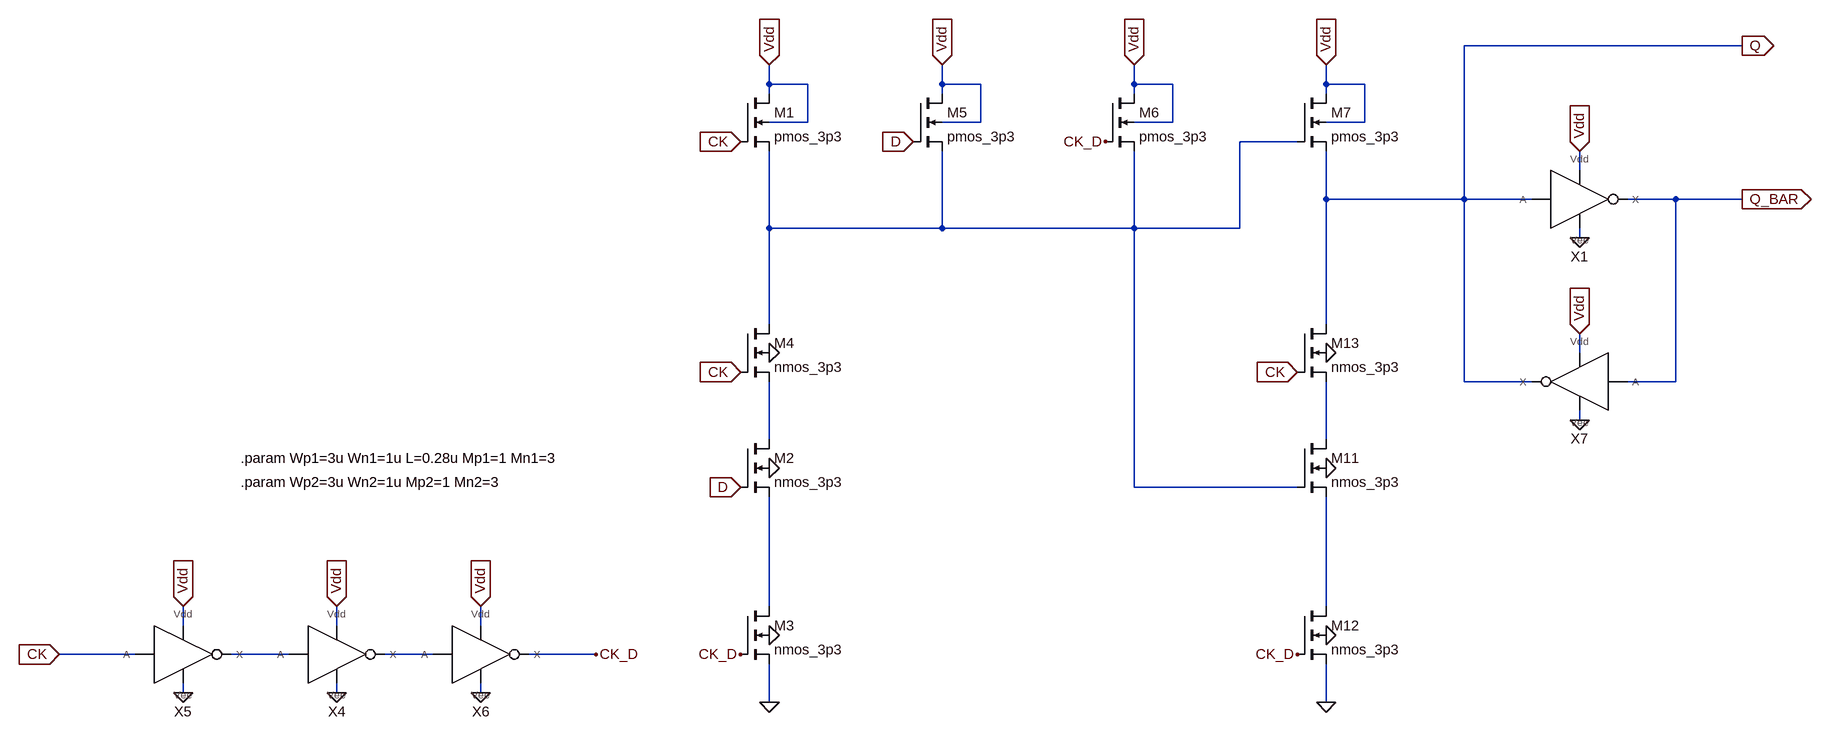
[diagram p0: schematic HLFF.asc]
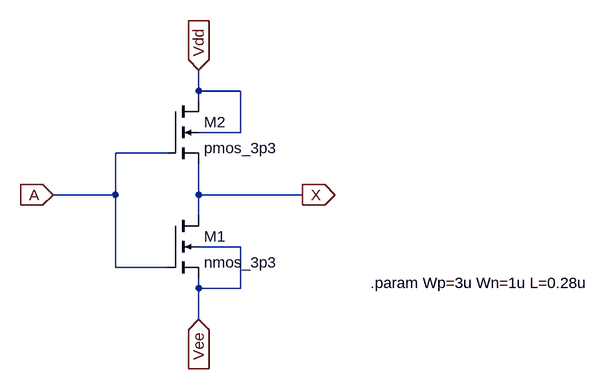
[diagram p1: sub-circuit invx1.asc]
HLFF.asc, the LTspice schematic file:
Version 4
SHEET 1 4028 772
WIRE 560 -608 64 -608
WIRE -1216 -544 -1216 -576
WIRE -1152 -544 -1216 -544
WIRE -928 -544 -928 -576
WIRE -864 -544 -928 -544
WIRE -608 -544 -608 -576
WIRE -544 -544 -608 -544
WIRE -288 -544 -288 -576
WIRE -224 -544 -288 -544
WIRE -1216 -528 -1216 -544
WIRE -928 -528 -928 -544
WIRE -608 -528 -608 -544
WIRE -288 -528 -288 -544
WIRE -1152 -480 -1152 -544
WIRE -1152 -480 -1216 -480
WIRE -864 -480 -864 -544
WIRE -864 -480 -928 -480
WIRE -544 -480 -544 -544
WIRE -544 -480 -608 -480
WIRE -224 -480 -224 -544
WIRE -224 -480 -288 -480
WIRE -336 -448 -432 -448
WIRE 256 -400 256 -432
WIRE -288 -352 -288 -432
WIRE 64 -352 64 -608
WIRE 64 -352 -288 -352
WIRE 176 -352 64 -352
WIRE 416 -352 336 -352
WIRE 560 -352 416 -352
WIRE -1216 -304 -1216 -432
WIRE -928 -304 -928 -432
WIRE -928 -304 -1216 -304
WIRE -608 -304 -608 -432
WIRE -608 -304 -928 -304
WIRE -432 -304 -432 -448
WIRE -432 -304 -608 -304
WIRE 256 -288 256 -304
WIRE -1216 -144 -1216 -304
WIRE -288 -144 -288 -352
WIRE 256 -96 256 -128
WIRE 64 -48 64 -352
WIRE 176 -48 64 -48
WIRE 416 -48 416 -352
WIRE 416 -48 336 -48
WIRE 256 16 256 0
WIRE -1216 48 -1216 -48
WIRE -288 48 -288 -48
WIRE -608 128 -608 -304
WIRE -336 128 -608 128
WIRE -1216 400 -1216 144
WIRE -288 400 -288 144
WIRE -2368 432 -2368 400
WIRE -2112 432 -2112 400
WIRE -1872 432 -1872 400
WIRE -2448 480 -2576 480
WIRE -2192 480 -2288 480
WIRE -1952 480 -2032 480
WIRE -1680 480 -1792 480
WIRE -2368 544 -2368 528
WIRE -2112 544 -2112 528
WIRE -1872 544 -1872 528
WIRE -1216 560 -1216 496
WIRE -288 560 -288 496
FLAG -1216 -576 Vdd
IOPIN -1216 -576 In
FLAG -1264 -448 CK
IOPIN -1264 -448 In
FLAG -1216 560 0
FLAG -1216 448 0
FLAG -1216 96 0
FLAG -1216 -96 0
FLAG -2576 480 CK
IOPIN -2576 480 In
FLAG -928 -576 Vdd
IOPIN -928 -576 In
FLAG -608 -576 Vdd
IOPIN -608 -576 In
FLAG -288 -576 Vdd
IOPIN -288 -576 In
FLAG -288 560 0
FLAG -288 448 0
FLAG -288 96 0
FLAG -288 -96 0
FLAG -2368 544 0
FLAG -2368 400 Vdd
IOPIN -2368 400 In
FLAG -2112 400 Vdd
IOPIN -2112 400 In
FLAG -1872 400 Vdd
IOPIN -1872 400 In
FLAG -2112 544 0
FLAG -1872 544 0
FLAG -1680 480 CK_D
FLAG -1264 -64 CK
IOPIN -1264 -64 In
FLAG -1264 128 D
IOPIN -1264 128 In
FLAG -976 -448 D
IOPIN -976 -448 In
FLAG -656 -448 CK_D
FLAG -336 480 CK_D
FLAG 256 -432 Vdd
IOPIN 256 -432 In
FLAG 256 -288 0
FLAG 256 -128 Vdd
IOPIN 256 -128 In
FLAG 256 16 0
FLAG 560 -608 Q
IOPIN 560 -608 Out
FLAG 560 -352 Q_BAR
IOPIN 560 -352 Out
FLAG -336 -64 CK
IOPIN -336 -64 In
FLAG -1264 480 CK_D
SYMBOL nmos4 -1264 -528 R0
SYMATTR InstName M1
SYMATTR Value pmos_3p3
SYMATTR Value2 l={L} w={Wp1} m={Mp1}
SYMBOL nmos4 -1264 48 R0
SYMATTR InstName M2
SYMATTR Value nmos_3p3
SYMATTR Value2 l={L} w={Wn1} m={Mn1}
SYMBOL nmos4 -1264 400 R0
SYMATTR InstName M3
SYMATTR Value nmos_3p3
SYMATTR Value2 l={L} w={Wn1} m={Mn1}
SYMBOL nmos4 -1264 -144 R0
SYMATTR InstName M4
SYMATTR Value nmos_3p3
SYMATTR Value2 l={L} w={Wn1} m={Mn1}
SYMBOL nmos4 -976 -528 R0
SYMATTR InstName M5
SYMATTR Value pmos_3p3
SYMATTR Value2 l={L} w={Wp1} m={Mp1}
SYMBOL nmos4 -656 -528 R0
SYMATTR InstName M6
SYMATTR Value pmos_3p3
SYMATTR Value2 l={L} w={Wp1} m={Mp1}
SYMBOL nmos4 -336 -528 R0
SYMATTR InstName M7
SYMATTR Value pmos_3p3
SYMATTR Value2 l={L} w={Wp2} m={Mp2}
SYMBOL nmos4 -336 48 R0
SYMATTR InstName M11
SYMATTR Value nmos_3p3
SYMATTR Value2 l={L} w={Wn2} m={Mn2}
SYMBOL nmos4 -336 400 R0
SYMATTR InstName M12
SYMATTR Value nmos_3p3
SYMATTR Value2 l={L} w={Wn2} m={Mn2}
SYMBOL nmos4 -336 -144 R0
SYMATTR InstName M13
SYMATTR Value nmos_3p3
SYMATTR Value2 l={L} w={Wn2} m={Mn2}
SYMBOL INVx1 -2112 480 R0
SYMATTR InstName X4
SYMBOL INVx1 -2368 480 R0
SYMATTR InstName X5
SYMBOL INVx1 -1872 480 R0
SYMATTR InstName X6
SYMBOL INVx1 256 -352 R0
SYMATTR InstName X1
SYMBOL INVx1 256 -48 M0
SYMATTR InstName X7
TEXT -2272 80 Left 2 !.param Wp1=3u Wn1=1u L=0.28u Mp1=1 Mn1=3
TEXT -2272 120 Left 2 !.param Wp2=3u Wn2=1u Mp2=1 Mn2=3

invx1.asc, the sub-circuit schematic file:
Version 4
SHEET 1 2776 836
WIRE 416 -16 416 -48
WIRE 480 -16 416 -16
WIRE 416 0 416 -16
WIRE 480 48 480 -16
WIRE 480 48 416 48
WIRE 368 80 288 80
WIRE 288 144 288 80
WIRE 288 144 192 144
WIRE 416 144 416 96
WIRE 576 144 416 144
WIRE 416 176 416 144
WIRE 480 224 416 224
WIRE 288 256 288 144
WIRE 368 256 288 256
WIRE 416 288 416 272
WIRE 480 288 480 224
WIRE 480 288 416 288
WIRE 416 336 416 288
FLAG 416 -48 Vdd
IOPIN 416 -48 In
FLAG 192 144 A
IOPIN 192 144 In
FLAG 576 144 X
IOPIN 576 144 Out
FLAG 416 336 Vee
IOPIN 416 336 In
SYMBOL nmos4 368 176 R0
SYMATTR InstName M1
SYMATTR Value nmos_3p3
SYMATTR Value2 l={L} w={Wn}
SYMBOL nmos4 368 0 R0
SYMATTR InstName M2
SYMATTR Value pmos_3p3
SYMATTR Value2 l={L} w={Wp}
TEXT 680 280 Left 2 !.param Wp=3u Wn=1u L=0.28u

The netlist it stands for:
* HLFF.asc
M1 Vdd CK N001 Vdd pmos_3p3 l={L} w={Wp1} m={Mp1}
M2 N002 D N004 0 nmos_3p3 l={L} w={Wn1} m={Mn1}
M3 N004 CK_D 0 0 nmos_3p3 l={L} w={Wn1} m={Mn1}
M4 N001 CK N002 0 nmos_3p3 l={L} w={Wn1} m={Mn1}
M5 Vdd D N001 Vdd pmos_3p3 l={L} w={Wp1} m={Mp1}
M6 Vdd CK_D N001 Vdd pmos_3p3 l={L} w={Wp1} m={Mp1}
M7 Vdd N001 Q Vdd pmos_3p3 l={L} w={Wp2} m={Mp2}
M11 N003 N001 N005 0 nmos_3p3 l={L} w={Wn2} m={Mn2}
M12 N005 CK_D 0 0 nmos_3p3 l={L} w={Wn2} m={Mn2}
M13 Q CK N003 0 nmos_3p3 l={L} w={Wn2} m={Mn2}
XX4 N006 Vdd N007 0 invx1
XX5 CK Vdd N006 0 invx1
XX6 N007 Vdd CK_D 0 invx1
XX1 Q Vdd Q_BAR 0 invx1
XX7 Q_BAR Vdd Q 0 invx1

* block symbol definitions
.subckt invx1 A Vdd X Vee
M1 X A Vee Vee nmos_3p3 l={L} w={Wn}
M2 Vdd A X Vdd pmos_3p3 l={L} w={Wp}
.param Wp=3u Wn=1u L=0.28u
.ends invx1

.model NMOS NMOS
.model PMOS PMOS
.lib standard.mos
.param Wp1=3u Wn1=1u L=0.28u Mp1=1 Mn1=3
.param Wp2=3u Wn2=1u Mp2=1 Mn2=3
.backanno
.end